# Altium schematic sheet ASBB_Servo.SchDoc
size A4
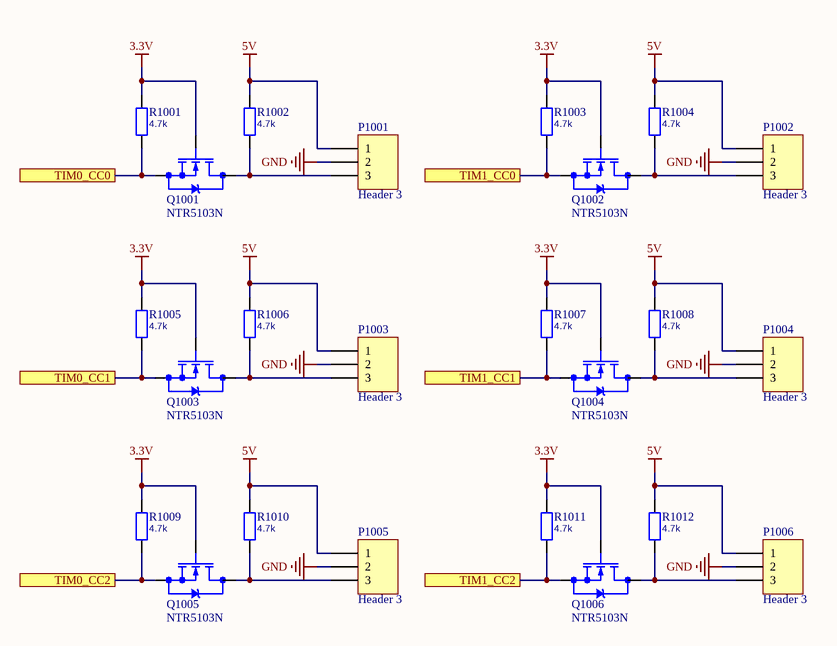
[diagram p0: ASBB_Servo.SchDoc]

## Parts
P1001  Header 3  [HDR1X3]
P1002  Header 3  [HDR1X3]
P1003  Header 3  [HDR1X3]
P1004  Header 3  [HDR1X3]
P1005  Header 3  [HDR1X3]
P1006  Header 3  [HDR1X3]
Q1001  NTR5103N  [SOT23]
Q1002  NTR5103N  [SOT23]
Q1003  NTR5103N  [SOT23]
Q1004  NTR5103N  [SOT23]
Q1005  NTR5103N  [SOT23]
Q1006  NTR5103N  [SOT23]
R1001  4.7k  [0603]
R1002  4.7k  [0603]
R1003  4.7k  [0603]
R1004  4.7k  [0603]
R1005  4.7k  [0603]
R1006  4.7k  [0603]
R1007  4.7k  [0603]
R1008  4.7k  [0603]
R1009  4.7k  [0603]
R1010  4.7k  [0603]
R1011  4.7k  [0603]
R1012  4.7k  [0603]

## Ports
TIM0_CC0, TIM0_CC1, TIM0_CC2, TIM1_CC0, TIM1_CC1, TIM1_CC2

## Nets
3.3V: Q1001.1(G) Q1002.1(G) Q1003.1(G) Q1004.1(G) Q1005.1(G) Q1006.1(G) R1001.2 R1003.2 R1005.2 R1007.2 R1009.2 R1011.2
5V: P1001.1 P1002.1 P1003.1 P1004.1 P1005.1 P1006.1 R1002.2 R1004.2 R1006.2 R1008.2 R1010.2 R1012.2
GND: P1001.2 P1002.2 P1003.2 P1004.2 P1005.2 P1006.2
TIM0_CC0: Q1001.2(S) R1001.1 ; port TIM0_CC0
TIM0_CC1: Q1003.2(S) R1005.1 ; port TIM0_CC1
TIM0_CC2: Q1005.2(S) R1009.1 ; port TIM0_CC2
TIM1_CC0: Q1002.2(S) R1003.1 ; port TIM1_CC0
TIM1_CC1: Q1004.2(S) R1007.1 ; port TIM1_CC1
TIM1_CC2: Q1006.2(S) R1011.1 ; port TIM1_CC2
NetP1001_3: P1001.3 Q1001.3(D) R1002.1
NetP1002_3: P1002.3 Q1002.3(D) R1004.1
NetP1003_3: P1003.3 Q1003.3(D) R1006.1
NetP1004_3: P1004.3 Q1004.3(D) R1008.1
NetP1005_3: P1005.3 Q1005.3(D) R1010.1
NetP1006_3: P1006.3 Q1006.3(D) R1012.1

## Library data of the parts
P1001-P1006 = Header 3: Header, 3-Pin; LatestRevisionDate: 17-Jul-2002; LatestRevisionNote: Re-released for DXP Platform.; Publisher: Altium Limited
Q1001-Q1006 = NMOS SOT23: N-Channel MOSFET SOT23; Value: ?; Partnumber: ?
R1001-R1012 = Resistor: Partnumber: ?; Value: ?